# Altium schematic sheet USB_Communication_Sheet.SchDoc
size A; SheetNumber: 7; SheetTotal: 7
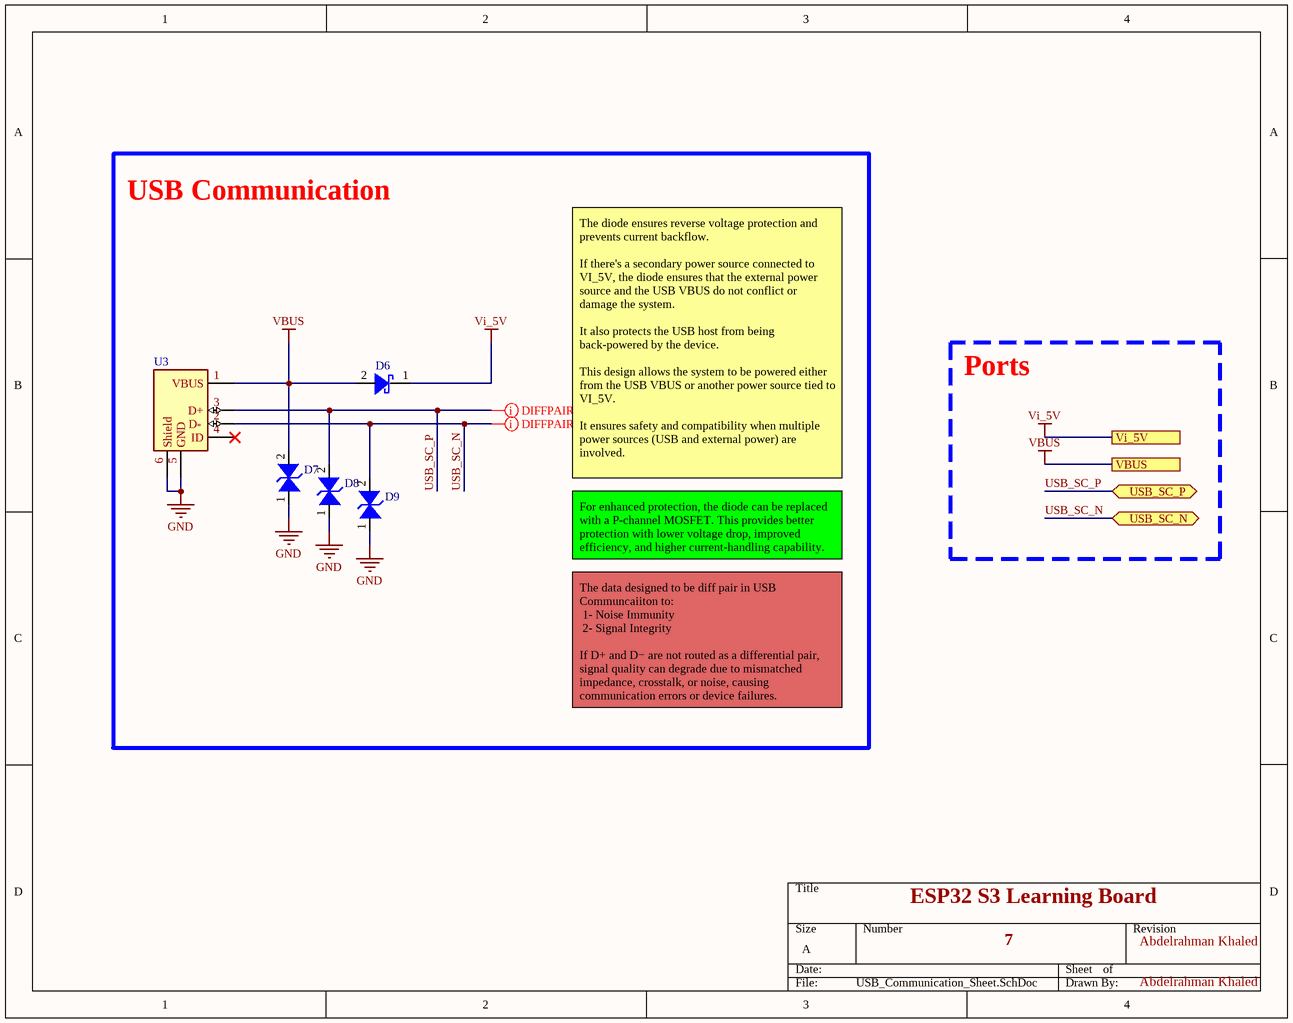
[diagram p0: USB_Communication_Sheet.SchDoc]

## Parts
D6  0.2V Drop Volt  [Schoktty Diode]  (value not drawn)
D7  TVS Diode  [TVS Diode]  (value not drawn)
D8  TVS Diode  [TVS Diode]  (value not drawn)
D9  TVS Diode  [TVS Diode]  (value not drawn)
U3  USB_B Micro  [USB8_Micro]  (value not drawn)

## Blocks framed on the sheet
USB Communication: D6-D9 U3

## Ports
USB_SC_N (bidir, see Block Diagram[2C], Microcontroller_ESP32_S3[4D]), USB_SC_P (bidir, see Block Diagram[2C], Microcontroller_ESP32_S3[4D]), VBUS (see Block Diagram[2C], USB_UART_Converter[4B]), Vi_5V (see Block Diagram[2C], LDO_Sheet[4B], Microcontroller_ESP32_S3[4D], RGB_Logical_Shifter_Sheet[4A], USB_UART_Converter[4A])

## Nets
GND: D7.1 D8.1 D9.1 U3.5(GND) U3.6(Shield)
VBUS: D6.2 D7.2 U3.1(VBUS) ; port VBUS
Vi_5V: D6.1 ; port Vi_5V
USB_SC_N: D9.2 U3.2(D-) ; port USB_SC_N
USB_SC_P: D8.2 U3.3(D+) ; port USB_SC_P

Not connected (* = marked no-connect by the designer): U3 4(ID)*

## Layout directives
differential pair; differential pair class Diff_90_ohm: USB_SC_N, USB_SC_P

## Notes on the sheet
- Ports
- The diode ensures reverse voltage protection and prevents current backflow.
  If there's a secondary power source connected to VI_5V, the diode ensures that the external power source and the USB VBUS do not conflict or damage the system.
  It also protects the USB host from being back-powered by the device.
  This design allows the system to be powered either from the USB VBUS or another power source tied to VI_5V.
  It ensures safety and compatibility when multiple power sources (USB and external power) are involved.
- For enhanced protection, the diode can be replaced with a P-channel MOSFET. This provides better protection with lower voltage drop, improved efficiency, and higher current-handling capability.
- The data designed to be diff pair in USB Communcaiiton to:
  1- Noise Immunity
  2- Signal Integrity
  If D+ and D− are not routed as a differential pair, signal quality can degrade due to mismatched impedance, crosstalk, or noise, causing communication errors or device failures.
- ESP32 S3 Learning Board
- 7
- Abdelrahman Khaled

## Library data of the parts
D6 = Schottky Diode: NRVB120ESFT1G; ComponentLink1Description: Link; ComponentLink1URL: https://www.digikey.com/en/products/detail/onsemi/NSR20F40NXT5G/5801655